# Altium schematic sheet Power_board_1.SchDoc
size A4; SheetNumber: 1; SheetTotal: 2
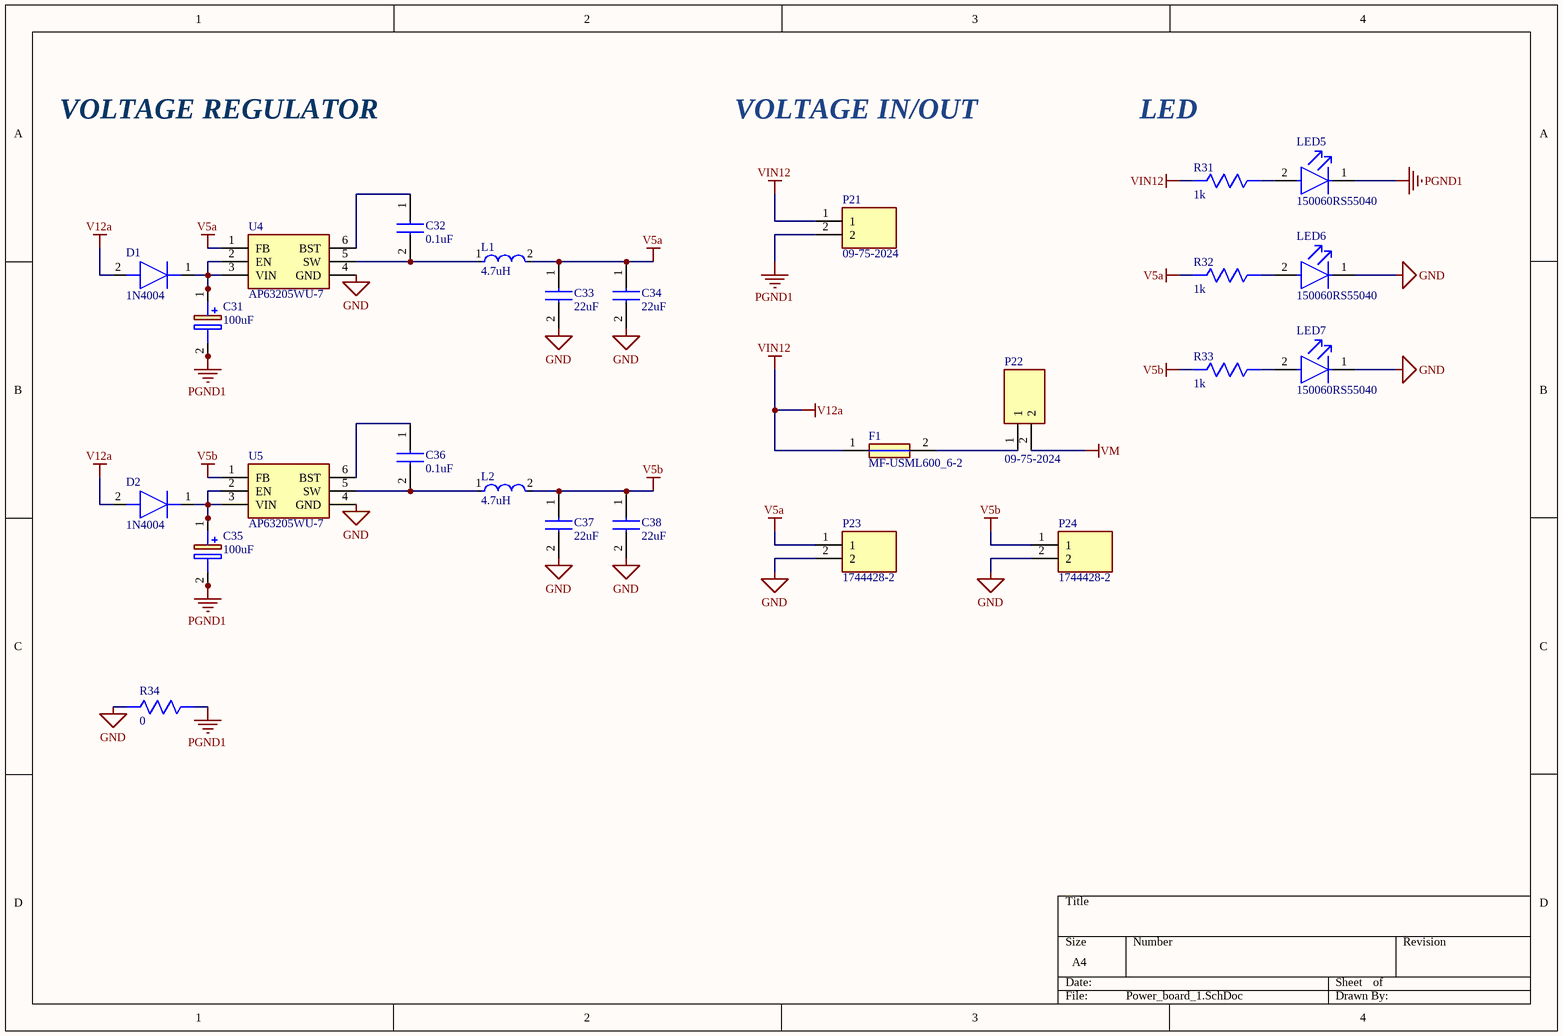
[diagram p0: Power_board_1.SchDoc]

## Parts
C31  100uF  [CAPPM7344X310N]
C32  0.1uF  [CAPC1608X90N]
C33  22uF  [C1608_Commercial]
C34  22uF  [C1608_Commercial]
C35  100uF  [CAPPM7344X310N]
C36  0.1uF  [CAPC1608X90N]
C37  22uF  [C1608_Commercial]
C38  22uF  [C1608_Commercial]
D1  1N4004  [DIOAD1413W86L463D238]
D2  1N4004  [DIOAD1413W86L463D238]
F1  MF-USML600_6-2  [FUSC3226X120N]
L1  4.7uH  [FP-NR6028-MFG]
L2  4.7uH  [FP-NR6028-MFG]
LED5  150060RS55040  [FP-150060RS55040-MFG]
LED6  150060RS55040  [FP-150060RS55040-MFG]
LED7  150060RS55040  [FP-150060RS55040-MFG]
P21  09-75-2024  [17444282]
P22  09-75-2024  [17444282]
P23  1744428-2  [17444282]
P24  1744428-2  [17444282]
R31  1k  [RESC1608X55N]
R32  1k  [RESC1608X55N]
R33  1k  [RESC1608X55N]
R34  0  [RESC1608X55N]
U4  AP63205WU-7  [SOT95P280X100-6N]
U5  AP63205WU-7  [SOT95P280X100-6N]

## Nets
GND: C33.2 C34.2 C37.2 C38.2 LED6.1(C) LED7.1(C) P23.2 P24.2 R34.1 U4.4(GND) U5.4(GND)
PGND1: C31.2(-) C35.2(-) LED5.1(C) P21.2 R34.2
V5a: C33.1 C34.1 L1.2 P23.1 R32.1 U4.1(FB)
V5b: C37.1 C38.1 L2.2 P24.1 R33.1 U5.1(FB)
V12a: D1.2(A) D2.2(A) F1.1 P21.1 R31.1  [also labelled VIN12]
VM: P22.2
NetC31_1: C31.1(+) D1.1(K) U4.2(EN) U4.3(VIN)
NetC32_1: C32.1 U4.6(BST)
NetC32_2: C32.2 L1.1 U4.5(SW)
NetC35_1: C35.1(+) D2.1(K) U5.2(EN) U5.3(VIN)
NetC36_1: C36.1 U5.6(BST)
NetC36_2: C36.2 L2.1 U5.5(SW)
NetF1_2: F1.2 P22.1
NetLED5_2: LED5.2(A) R31.2
NetLED6_2: LED6.2(A) R32.2
NetLED7_2: LED7.2(A) R33.2

## Notes on the sheet
- VOLTAGE REGULATOR
- VOLTAGE IN/OUT
- LED

## Library data of the parts
C31 C35 = TAJD107K016RNJ: Capacitor Polarised; Manufacturer_Name: AVX; Datasheet Link: http://datasheets.avx.com/TAJ.pdf; Height: 3.1mm; Manufacturer_Part_Number: TAJD107K016RNJ; Mouser Part Number: 581-TAJD107K016R; Mouser Price/Stock: https://www.mouser.co.uk/ProductDetail/AVX/TAJD107K016RNJ?qs=srZBJ3srS4Aek4oWmPB2bw%3D%3D; Arrow Part Number: TAJD107K016RNJ; Arrow Price/Stock: https://www.arrow.com/en/products/tajd107k016rnj/avx
C32 C36 = GRM188R72A104MA35D: Capacitor; Manufacturer_Name: Murata Electronics; Height: 0.9mm; Manufacturer_Part_Number: GRM188R72A104MA35D; Mouser Part Number: 81-GRM188R72A104MA5D; Mouser Price/Stock: https://www.mouser.co.uk/ProductDetail/Murata-Electronics/GRM188R72A104MA35D?qs=QdePRyQsNGaEtttrWFG%2FPQ%3D%3D; Arrow Part Number: GRM188R72A104MA35D; Arrow Price/Stock: https://www.arrow.com/en/products/grm188r72a104ma35d/murata-manufacturing?region=nac
C33 C34 C37 C38 = C1608X5R1H104M080AA: Capacitor; Manufacturer_Name: TDK; Datasheet Link: https://product.tdk.com/system/files/dam/doc/product/capacitor/ceramic/mlcc/catalog/mlcc_commercial_general_en.pdf; Height: 0.9mm; Manufacturer_Part_Number: C1608X5R1H104M080AA
D1 D2 = 1N4004: Diode; Manufacturer_Name: onsemi; Datasheet Link: https://datasheet.datasheetarchive.com/originals/distributors/Datasheets-24/DSA-461675.pdf; Manufacturer_Part_Number: 1N4004; Mouser Part Number: 863-1N4004; Mouser Price/Stock: http://www.mouser.com/Search/ProductDetail.aspx?qs=y2kkmE52mdNwTMdxP3IlZA%3d%3d; Arrow Part Number: 1N4004; Arrow Price/Stock: https://www.arrow.com/en/products/1n4004/on-semiconductor
F1 = MF-USML600_6-2: Fuse; Manufacturer_Name: Bourns; Manufacturer_Part_Number: MF-USML600/6-2; Datasheet Link: https://www.bourns.com/docs/product-datasheets/mf-usml.pdf?sfvrsn=75cb6af6_18; Height: 1.2mm; Mouser Part Number: 652-MF-USML600/6-2; Mouser Price/Stock: https://www.mouser.com/Search/Refine.aspx?Keyword=652-MF-USML600%2F6-2
L1 L2 = CMP-14484-000746-1: SMD Power Inductors for Automotive Applications 4.7uH ±20% 2.7A 40.3mΩ; Max DC Current: 3A; Core Material: Ferrite; Shielding: Shielded; Test Frequency: 100kHz; DC Resistance (DCR): 40.3mR; Self Resonant Frequency: 39MHz; Min Operating Temperature: -25°C; Package Quantity: 2000; Resistor Type: Wirewound; Length: 0.236inch; Ratings: AEC-Q200; Depth: 6mm; Packaging: Tape and Reel; Height: 2.8mm; Radiation Hardening: No; Halogen Free: Halogen Free; Saturation Current: 2.7A; Max Operating Temperature: 125°C; Width: 6mm; Inductance: 4.7uH; RoHS Compliant: Yes; Mount: Surface Mount; Height - Seated (Max): 0.11inch; Current Rating: 3A; Tolerance: 20%; Termination: SMD/SMT; Case/Package: Nonstandard
LED5-LED7 = CMP-207942-000007-1: LED RED DIFFUSED 0603 SMD; Lens Style: Flat; Lens Size: 0.8mm; Luminous Intensity: 90mcd; Test Current: 20mA; Forward Voltage: 2V; Dominant Wavelength: 624nm; Viewing Angle: 140°; Width: 0.8mm; Mount: Surface Mount; Height: 0.5mm; Case/Package: 0603; Packaging: Cut Tape; Length: 1.6mm; RoHS Compliant: No; Color: Red; Case Code (Imperial): 0603; Lens Transparency: Diffused; Case Code (Metric): 1608
P21-P24 = 1744428-2: Connector; Manufacturer_Name: TE Connectivity; Datasheet Link: https://www.te.com/commerce/DocumentDelivery/DDEController?Action=srchrtrv&DocNm=1744428&DocType=Customer+Drawing&DocLang=English; Height: 8.8mm; Manufacturer_Part_Number: 1744428-2; Mouser Part Number: 571-1744428-2; Mouser Price/Stock: https://www.mouser.co.uk/ProductDetail/TE-Connectivity/1744428-2?qs=%2F6W%2F9%2FHWvcDoOfykajFB2Q%3D%3D
R31-R34 = CMP0603-FX-1003ELF: Resistor; Manufacturer_Name: Bourns; Datasheet Link: https://www.mouser.co.uk/datasheet/2/54/Bourns_CMP_Datasheet_05.28.20-1854233.pdf; Height: 0.55mm; Manufacturer_Part_Number: CMP0603-FX-1003ELF
U4 U5 = AP63205WU-7: Integrated Circuit; Manufacturer_Name: Diodes Inc.; Datasheet Link: https://www.diodes.com/assets/Datasheets/AP63200-AP63201-AP63203-AP63205.pdf; Height: 1mm; Manufacturer_Part_Number: AP63205WU-7; Mouser Part Number: 621-AP63205WU-7; Mouser Price/Stock: https://www.mouser.co.uk/ProductDetail/Diodes-Incorporated/AP63205WU-7?qs=u16ybLDytRZtkj8PzdWCOw%3D%3D; Arrow Part Number: AP63205WU-7; Arrow Price/Stock: https://www.arrow.com/en/products/ap63205wu-7/diodes-incorporated?region=nac